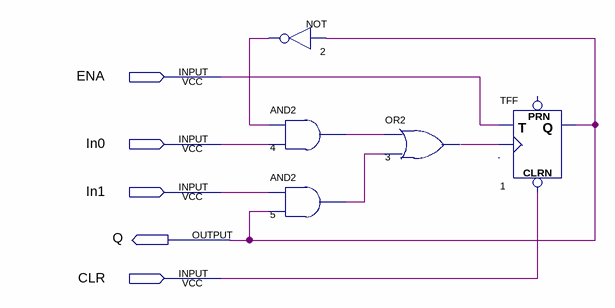
[diagram p0: schematic sheet]
// Quartus schematic dbltff.bdf as structural Verilog: 5 symbols, 5 pins
module dbltff (
  input  ENA,
  input  In0,
  input  In1,
  input  CLR,
  output Q
);

  wire n2_out, n3_out, n4_out, n5_out;

  not u_2 (n2_out, Q);
  and u_4 (n4_out, n2_out, In0);
  and u_5 (n5_out, In1, Q);
  or u_3 (n3_out, n4_out, n5_out);
  TFF u_1 (.CLRN(CLR), .T(ENA), .CLK(n3_out), .Q(Q));  // open: PRN
endmodule
